# EAGLE board snowflake-hw-v1.0.1 R5 (EAGLE 9.6.2), part 1 of 2
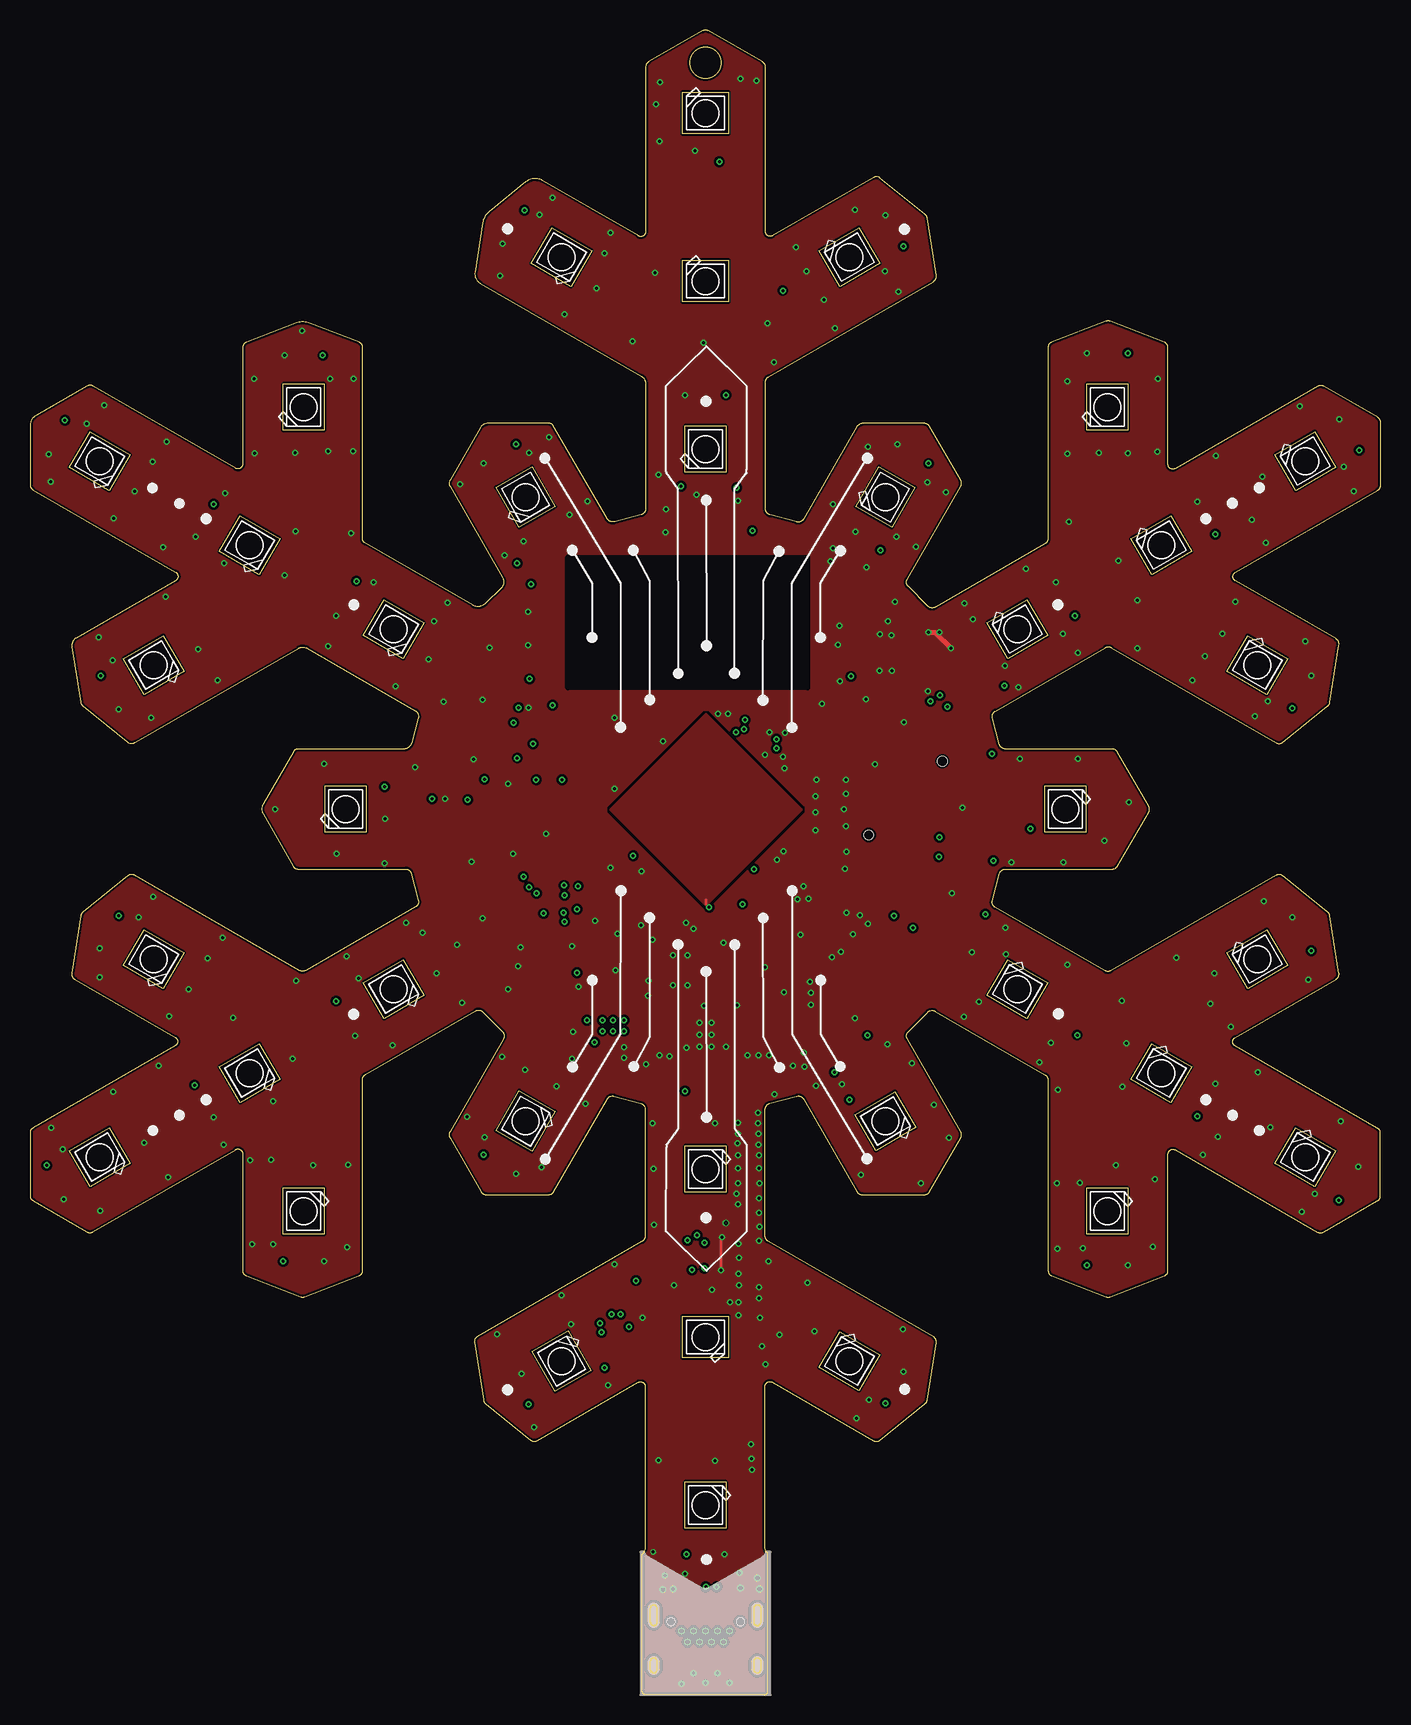
[diagram p2: board, top side]
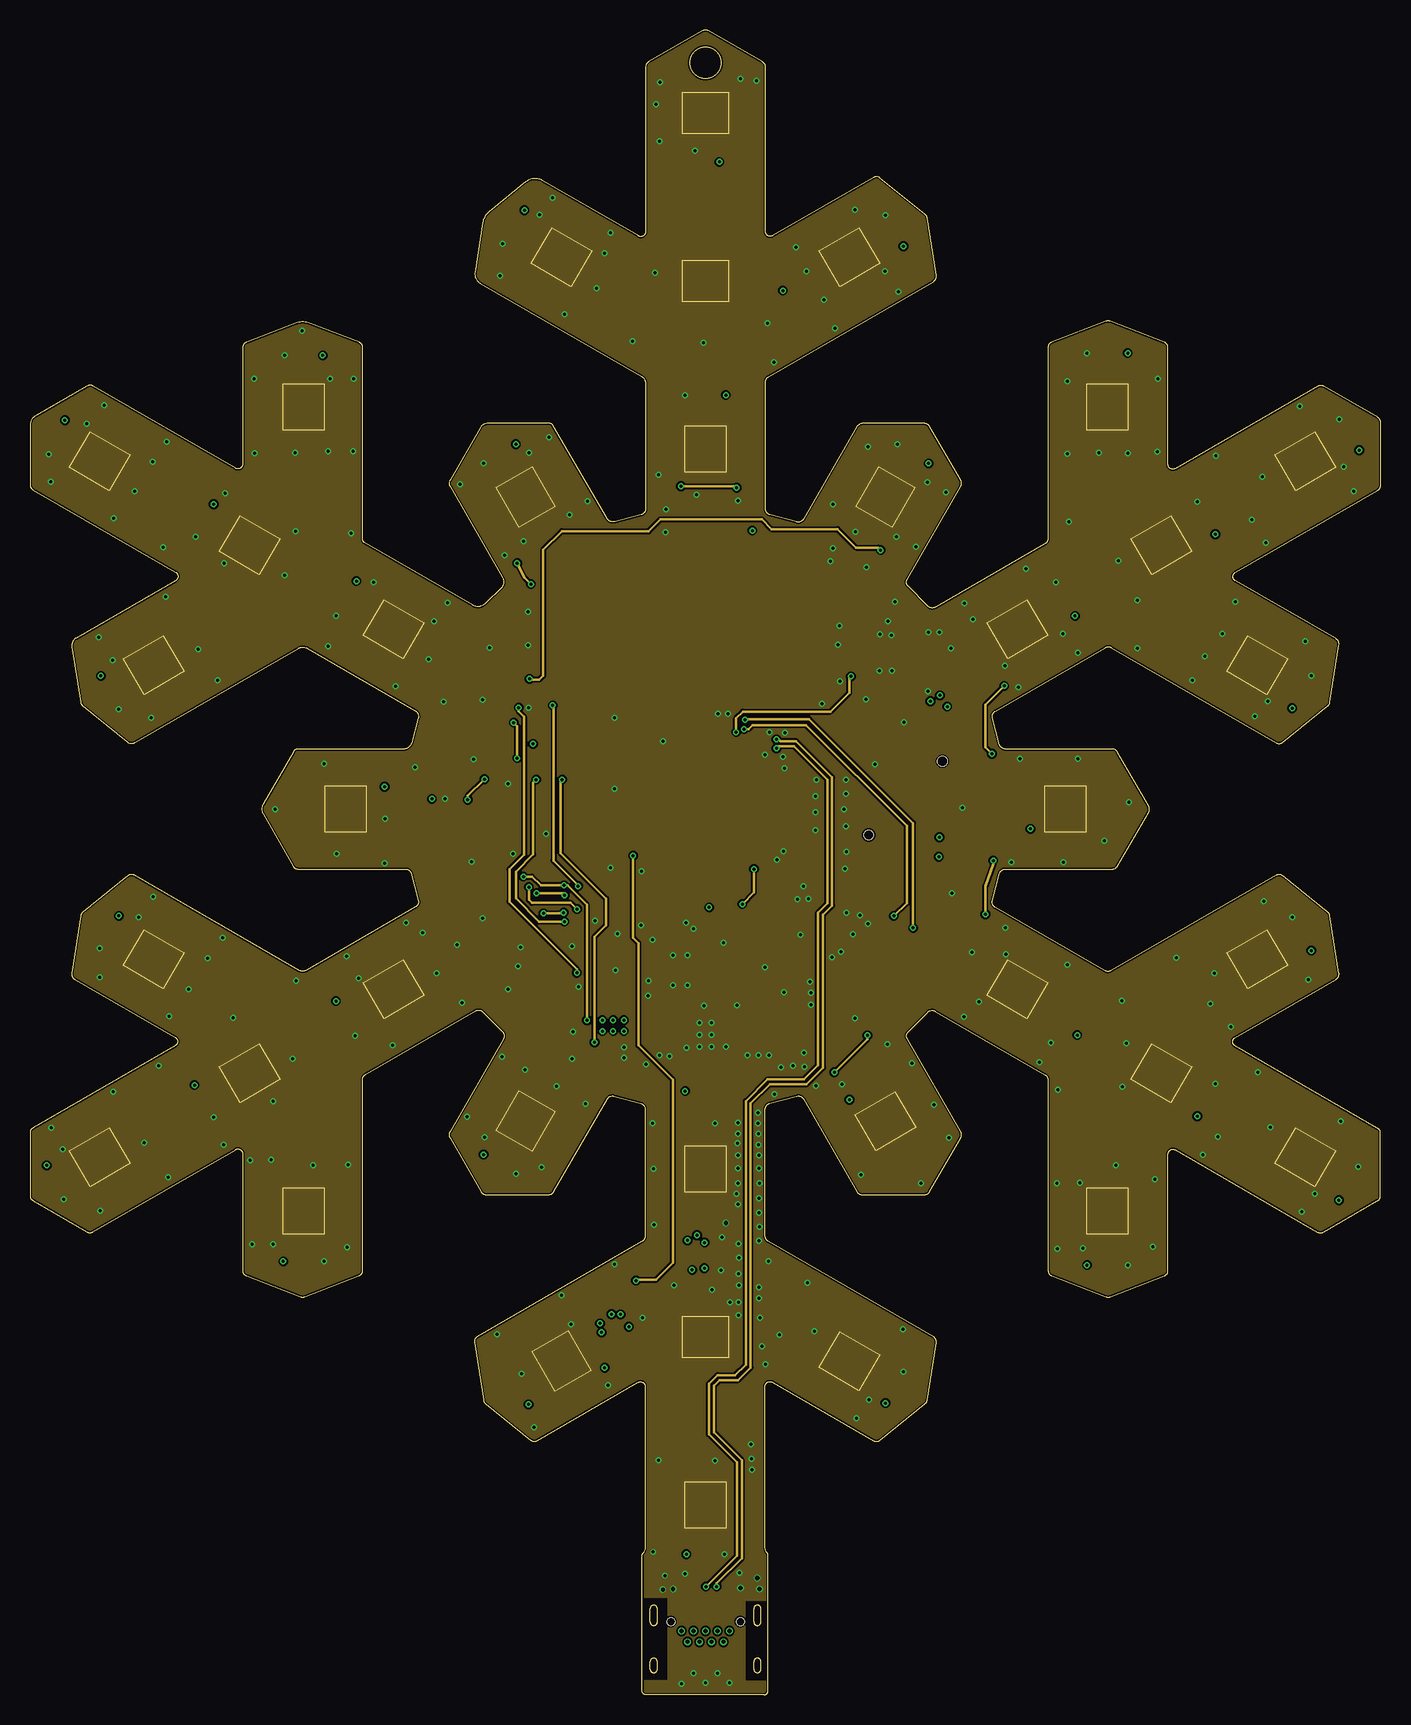
[diagram p3: board, inner layer Route2]
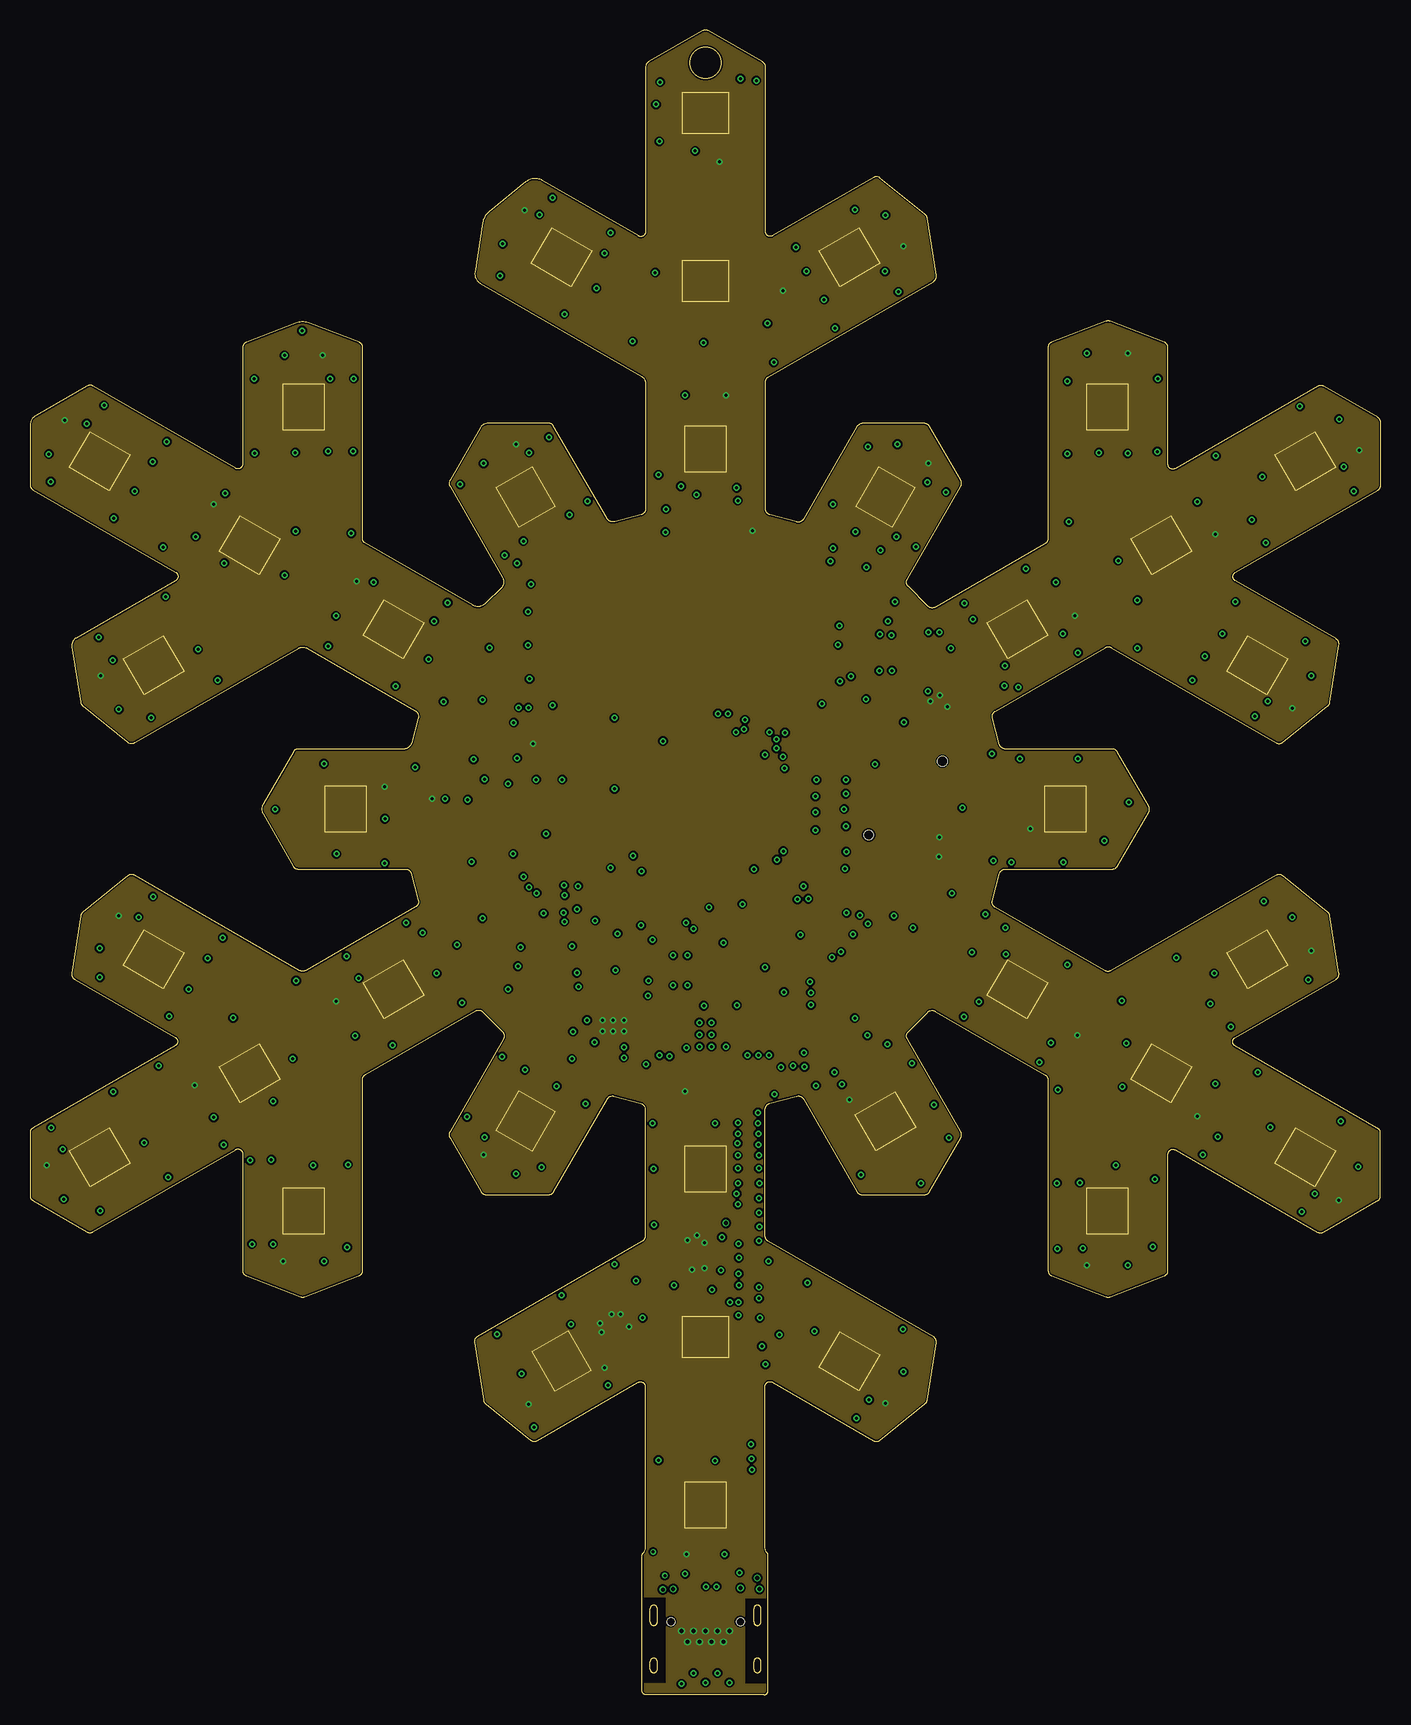
[diagram p4: board, inner layer Route15]
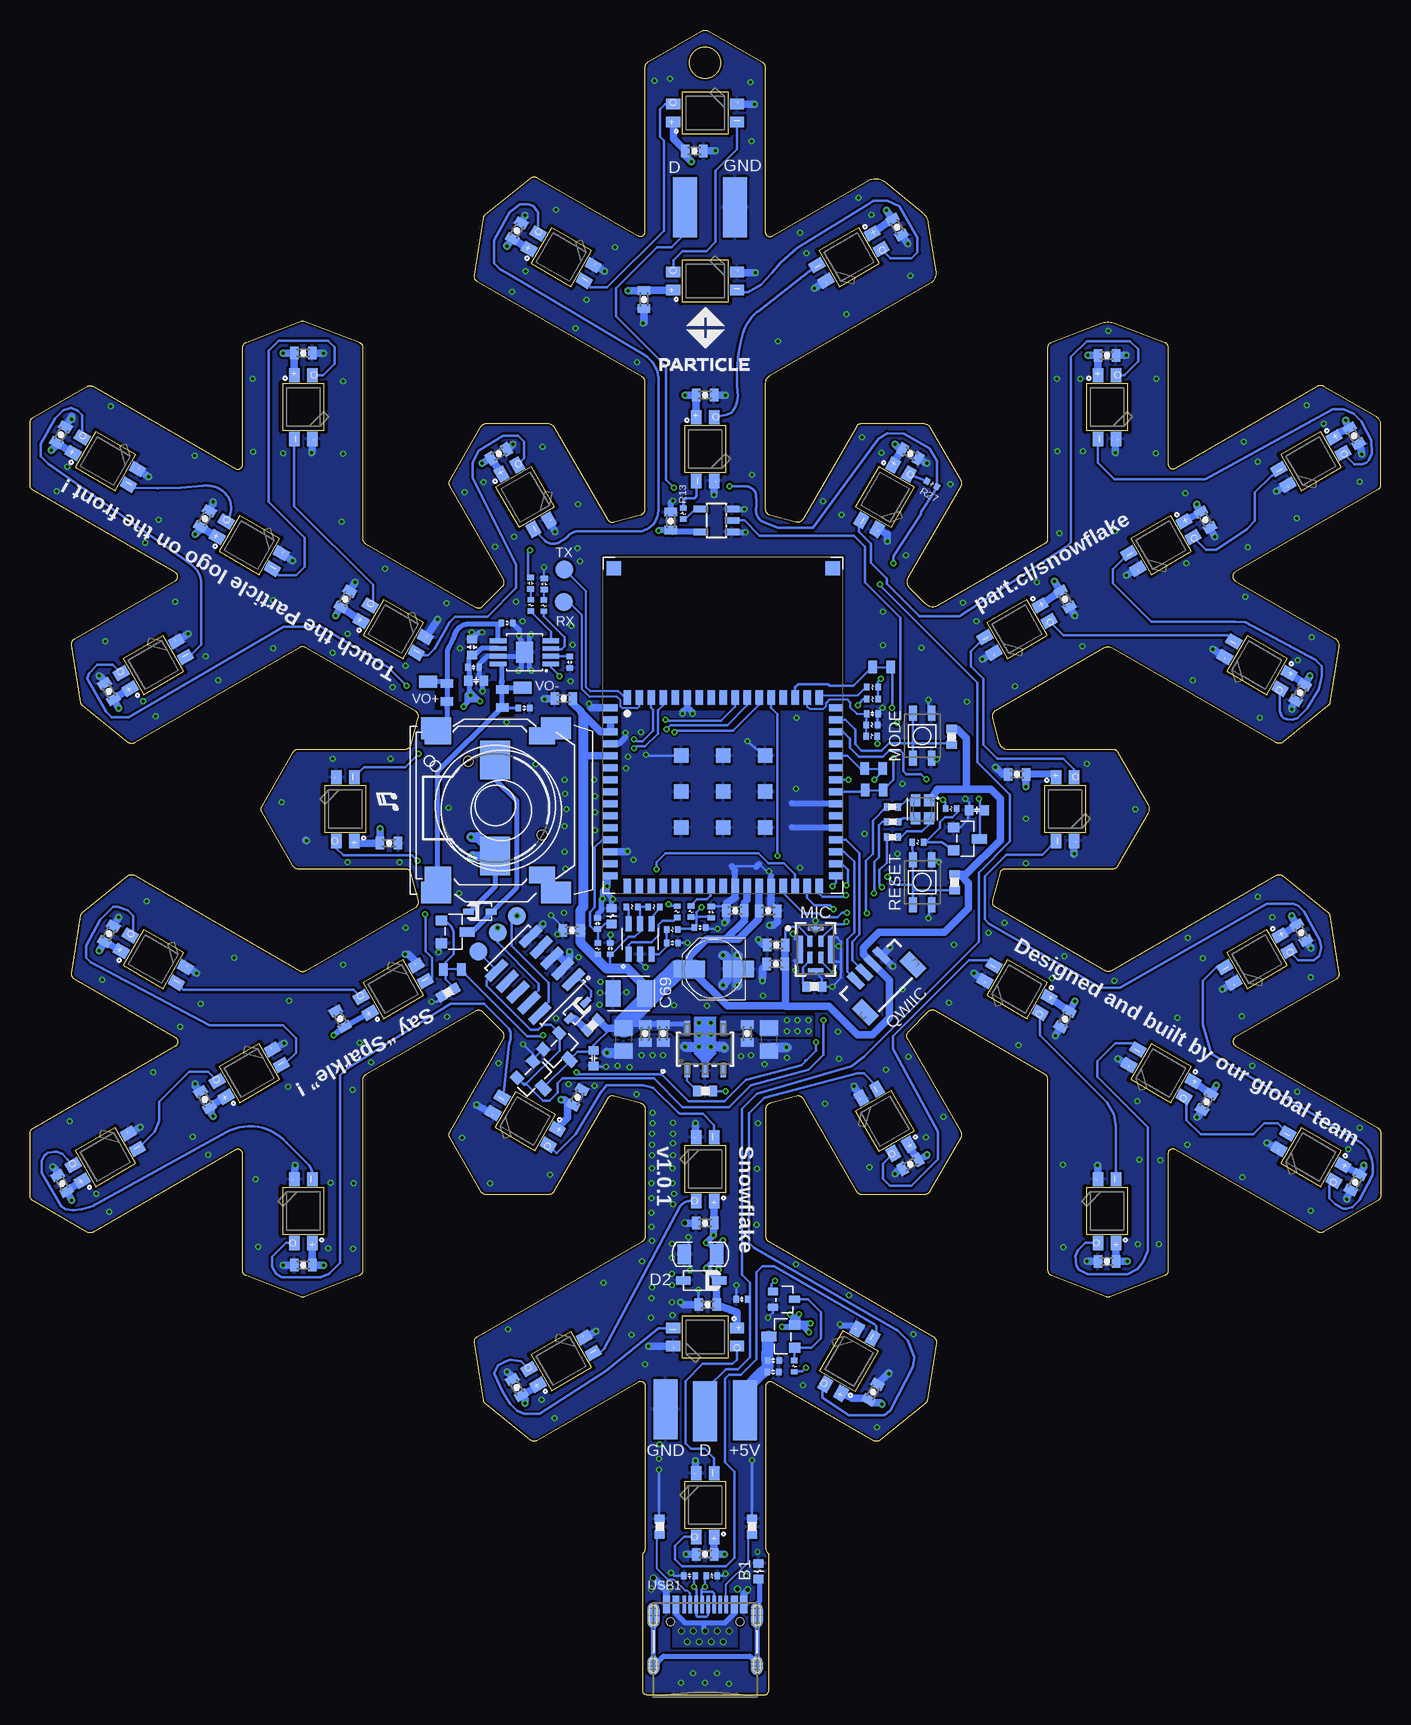
[diagram p5: board, bottom side, seen from below]

Size 112.6 x 138.75 mm. Coordinates in mm from the lower left corner, seen from the top.
Outline: 39.3,92.29 37.95,90.93 arc-75 36.93,90.8 27.92,96 arc-60 27.73,96.33 27.73,112.33 arc69 27.46,112.72 23.31,114.32 arc42 22.15,114.32 18.04,112.73 arc69 17.73,112.28 17.73,102.58 arc-120 17.13,102.23 5.28,109.07 arc60 4.75,109.07 0.46,106.6 arc60 0.01,105.83 0.01,100.83 arc60 0.24,100.44 12.14,93.56 arc-120 12.14,92.87 3.84,88.08 arc69 3.5,87.36 4.23,82.72 arc42 4.39,82.43 8.1,79.44 arc69 8.78,79.38 22.38,87.23 arc-60 23.11,87.23 32.1,82.04 arc-75 32.37,81.41 31.81,79.33 arc-75 31.15,78.83 22.31,78.83 arc60 21.96,78.62 19.42,74.22 arc60 19.42,73.44 21.95,69.05 arc60 22.33,68.83 31.31,68.83 arc-75 31.76,68.48 32.37,66.23 arc-75 32.14,65.67 22.96,60.37 arc-60 22.46,60.37 8.72,68.31 arc69 8.16,68.26 4.4,65.23 arc42 4.22,64.92 3.48,60.16 arc69 3.72,59.65 12.11,54.8 arc-120 12.11,54.11 0.25,47.26 arc60 0,46.82 0,41.63 arc60 0.25,41.2 4.75,38.6 arc60 5.25,38.6 17.13,45.46 arc-120 17.73,45.11 17.73,35.38 arc69 18.05,34.92 22.55,33.18 arc42 22.91,33.18 27.41,34.92 arc69 27.73,35.38 27.73,51.29 arc-60 27.98,51.72 37.14,57.01 arc-75 37.74,56.93 39.39,55.28 arc-75 39.47,54.67 35,46.94 arc60 35,46.44 37.6,41.94 arc60 38.03,41.69 43.23,41.69 arc60 43.66,41.94 48.12,49.67 arc-75 48.69,49.9 50.91,49.3 arc-75 51.28,48.82 51.28,38.23 arc-60 51.03,37.8 37.29,29.86 arc69 37.05,29.35 37.79,24.59 arc42 37.97,24.28 41.73,21.25 arc69 42.29,21.2 50.68,26.05 arc-120 51.28,25.7 51.28,12.34 arc-45 51.05,11.77 arc45 51.01,11.67 51.01,0.4 arc90 51.41,0 61.18,0 arc90 61.51,0.33 61.51,11.73 arc45 61.48,11.8 arc-45 61.28,12.28 61.28,25.72 arc-120 61.88,26.07 70.31,21.2 arc69 70.87,21.25 74.62,24.28 arc42 74.8,24.59 75.55,29.35 arc69 75.31,29.86 61.53,37.82 arc-60 61.28,38.25 61.28,48.81 arc-75 61.65,49.3 63.91,49.9 arc-75 64.47,49.67 68.93,41.94 arc60 69.37,41.69 74.56,41.69 arc60 75,41.94 77.59,46.44 arc60 77.59,46.94 73.13,54.67 arc-75 73.21,55.28 74.84,56.9 arc-75 75.44,56.98 84.62,51.69 arc-60 84.87,51.25 84.87,35.38 arc69 85.19,34.92 89.69,33.18 arc42 90.05,33.18 94.55,34.92 arc69 94.87,35.38 94.87,45.08 arc-120 95.47,45.42 107.33,38.57 arc60 107.83,38.57 112.33,41.17 arc50 112.58,41.51 112.58,46.89 arc54 112.33,47.23 100.45,54.09 arc-120 100.45,54.78 108.88,59.65 arc69 109.12,60.16 108.37,64.92 arc42 108.19,65.23 104.44,68.26 arc69 103.88,68.31 90.1,60.35 arc-60 89.6,60.35 80.45,65.64 arc-75 80.22,66.2 80.83,68.46 arc-75 81.31,68.83 90.23,68.83 arc60 90.66,69.08 93.26,73.58 arc60 93.26,74.08 90.66,78.58 arc60 90.23,78.83 81.31,78.83 arc-75 80.83,79.2 80.23,81.42 arc-75 80.46,81.99 89.63,87.28 arc-60 90.13,87.28 103.88,79.35 arc69 104.44,79.39 108.19,82.42 arc42 108.37,82.73 109.12,87.5 arc69 108.88,88.01 100.48,92.85 arc-120 100.48,93.55 112.35,100.4 arc53 112.6,100.77 112.6,106.08 arc56 112.35,106.46 107.85,109.06 arc60 107.35,109.06 95.47,102.2 arc-120 94.87,102.54 94.87,112.27 arc69 94.55,112.74 90.05,114.47 arc42 89.69,114.47 85.14,112.72 arc69 84.87,112.33 84.87,96.37 arc-60 84.62,95.93 75.46,90.65 arc-75 74.86,90.73 73.21,92.38 arc-75 73.13,92.98 77.59,100.71 arc60 77.59,101.21 75,105.71 arc60 74.56,105.96 69.37,105.96 arc33 68.93,105.71 64.47,97.98 arc-75 63.91,97.75 61.68,98.35 arc-75 61.31,98.84 61.31,109.42 arc-60 61.56,109.86 75.31,117.79 arc69 75.55,118.3 74.8,123.07 arc42 74.62,123.38 70.87,126.41 arc69 70.31,126.45 61.91,121.61 arc-120 61.31,121.95 61.31,135.65 arc60 61.06,136.08 56.56,138.68 arc60 56.06,138.68 51.56,136.08 arc60 51.31,135.65 51.31,121.93 arc-120 50.71,121.59 42.73,126.2 arc69 41.33,126.09 38.27,123.62 arc42 37.73,122.68 37.09,118.58 arc69 37.53,117.65 50.98,109.89 arc-60 51.31,109.31 51.31,98.84 arc-75 50.94,98.36 48.76,97.77 arc-75 48.09,98.05 43.62,105.78 arc60 43.31,105.96 38.1,105.96 arc47 37.57,105.66 35.01,101.22 arc60 35.01,100.71 39.4,93.09 arc-75 39.3,92.29
Outline: circle at 56.31,136.03 radius 1.3
Copper layers (1+2*15+16): Top 0.018mm / dielectric 0.195mm / Route2 0.035mm / dielectric 1.1mm / Route15 0.035mm / dielectric 0.195mm / Bottom 0.018mm
Design rules "particle-4layer *": minimum track width 6mil, minimum drill 0.25mm, track to track 6mil, track to pad 6mil, pad to pad 6mil, via to via 6mil, smd to smd 0mil, copper to edge 6mil, drill to drill 6mil, minimum pad ring 12mil, minimum via ring 4mil, stop-mask expansion 0.01mm, vias tented up to drill 20mil, thermal gap 8mil
Net classes: 0 default: width 0.152 mm, clearance 0.152 mm; 1 usb: width 0.2 mm, clearance 0.2 mm to class 0, clearance 0.2 mm

## Footprints (pad centres in the part's own frame; a part is rotated, then mirrored left to right if it is on the bottom)
TP_2X5MM = smd 2 x 5: P$1 0,0
R-0603A = smd 0.7 x 0.85: 1 -0.65,0; 2 0.65,0
C0603_P = smd 0.711 x 1.041: 1 -0.749,0; 2 0.749,0
C0805 = smd 1.3 x 1.5: 1 -0.95,0; 2 0.95,0
PANASONIC_C = smd 2.6 x 1.4: + 2.05,0; - -2.05,0
C0603 = smd 0.7 x 0.85: 1 -0.65,0; 2 0.65,0
C-0603A = smd 0.7 x 0.85: 1 -0.65,0; 2 0.65,0
C0402 = smd 0.45 x 0.6: 1 -0.47,0; 2 0.47,0
C-0402 = smd 0.45 x 0.55: 1 -0.47,0; 2 0.47,0
C1206 = smd 1.1 x 1.65: 1 -1.35,0; 2 1.35,0
CASE-B = smd 2.2 x 1.25: P$1 0,-1.32; P$2 0,1.32
CONN5X2_1.27 = smd 0.7 x 2.1: 1 -2.54,-2; 2 -2.54,2; 3 -1.27,-2; 4 -1.27,2; 5 0,-2; 6 0,2; 7 1.27,-2; 8 1.27,2; 9 2.54,-2; 10 2.54,2
SOD-323 = smd 0.9 x 0.5: 1 -0.95,0; 2 0.95,0
SOD-123 = smd 1.2 x 0.7: 1 -1.5,0; 2 1.5,0
SOT23-5L = smd 0.55 x 1.2: 1 -0.95,-1.3; 2 0,-1.3; 3 0.95,-1.3; 4 0.95,1.3; 5 -0.95,1.3
JST04_1MM_VERT = smd 0.6 x 1.55: 1 -1.5,0.775; 2 -0.5,0.775; 3 0.5,0.775; 4 1.5,0.775 | smd 1.2 x 2: NC1 -2.8,3.2; NC2 2.8,3.2
PLCC4-2MM-RGB = smd 1 x 0.8: BLUE -0.75,-0.55; CA 0.75,-0.55; GREEN -0.75,0.55; RED 0.75,0.55
NEO3535_REVERSE = smd 1.2 x 0.9 bottom: 1-VDD 2.65,-0.75; 2-DOUT 2.65,0.75; 3-GND -2.65,0.75; 4-DIN -2.65,-0.75
BUZZER-CCV = smd 3.2 x 2.5: + 4,0; - -4,0 | hole 0.8: -3.9,-2.25; 2.25,3.9
SOT323 = smd 0.6 x 0.8: 1 -0.65,-0.95; 2 0.65,-0.95 | smd 0.6 x 0.9: 3 0,0.85
SOT-23 = smd 0.8 x 0.95: 1 -0.95,-1; 2 0.95,-1 | smd 0.8 x 1.25: 3 0,1.15
R0402_P = smd 0.457 x 0.61: 1 -0.483,0; 2 0.483,0
R0603_P = smd 0.7 x 0.85: 1 -0.65,0; 2 0.65,0
R-0402S = smd 0.45 x 0.55: 1 -0.47,0; 2 0.47,0
TACTILE_SWITCH_SMD = smd 1.25 x 0.65: 1 -1.875,0.775; 2 1.875,0.775; 3 -1.875,-0.775; 4 1.875,-0.775
TP = smd 1.5 x 1.5: TP 0,0
P2 = smd 1.2 x 0.6: 1 -9.4,2.45; 2 -9.4,1.45; 3 -9.4,0.45; 4 -9.4,-0.55; 5 -9.4,-1.55; 6 -9.4,-2.55; 7 -9.4,-3.55; 8 -9.4,-4.55; 9 -9.4,-5.55; 10 -9.4,-6.55; 11 -9.4,-7.55; 12 -9.4,-8.55; 13 -9.4,-9.55; 14 -9.4,-10.55; 15 -9.4,-11.55; 33 9.4,-11.55; 34 9.4,-10.55; 35 9.4,-9.55; 36 9.4,-8.55; 37 9.4,-7.55; 38 9.4,-6.55; 39 9.4,-5.55; 40 9.4,-4.55; 41 9.4,-3.55; 42 9.4,-2.55; 43 9.4,-1.55; 44 9.4,-0.55; 45 9.4,0.45; 46 9.4,1.45; 47 9.4,2.45 | smd 0.6 x 1.2: 16 -8,-12.4; 17 -7,-12.4; 18 -6,-12.4; 19 -5,-12.4; 20 -4,-12.4; 21 -3,-12.4; 22 -2,-12.4; 23 -1,-12.4; 24 0,-12.4; 25 1,-12.4; 26 2,-12.4; 27 3,-12.4; 28 4,-12.4; 29 5,-12.4; 30 6,-12.4; 31 7,-12.4; 32 8,-12.4; 48 8,3.3; 49 7,3.3; 50 6,3.3; 51 5,3.3; 52 4,3.3; 53 3,3.3; 54 2,3.3; 55 1,3.3; 56 0,3.3; 57 -1,3.3; 58 -2,3.3; 59 -3,3.3; 60 -4,3.3; 61 -5,3.3; 62 -6,3.3; 63 -7,3.3; 64 -8,3.3 | smd 1.2 x 1.2: 65 -3.5,-1.55; 66 -3.5,-4.55; 67 -3.5,-7.55; 68 0,-1.55; 69 0,-4.55; 70 0,-7.55; 71 3.5,-1.55; 72 3.5,-4.55; 73 3.5,-7.55; 74 9.12,14.07; 75 -9.12,14.07
MP34DT05TR-A_STM = smd 0.406 x 0.94: 1 -0.45,0.675; 2 -0.45,-0.675; 3 0.45,-0.675; 4 0.45,0.675 | smd 1.295 x 0.356: 5 0,1.725; 6 0,-1.725 | smd 0.356 x 2.311: 7 -1.225,0; 8 1.225,0
SOT-89-5_TOR-M = smd 0.483 x 1.118: 1 -1.5,-1.803; 3 1.5,-1.803; 4 1.5,1.803; 5 -1.5,1.803 | smd 0.533 x 1.118: 2 0,-1.803
MSOP-8 = smd 1.4 x 0.4: 1 -2.2,0.975; 2 -2.2,0.325; 3 -2.2,-0.325; 4 -2.2,-0.975; 5 2.2,-0.975; 6 2.2,-0.325; 7 2.2,0.325; 8 2.2,0.975 | smd 1.425 x 1.76: 9 0,0
SOT-23-6 = smd 1.27 x 0.508: 1 -1.27,0.953; 2 -1.27,0; 3 -1.27,-0.953; 4 1.27,-0.953; 5 1.27,0; 6 1.27,0.953
KJL-01304T(13X13MM) = smd 1.4 x 2.2: LEAD+ -5.8,-4.8; LEAD- 5.8,-4.8; P$1 -5.8,3.9; P$2 5.8,3.9
JMP_0603_NC = smd 0.711 x 1.041: 1 -0.749,0; 2 0.749,0
KLJ-01504T = smd 1.8 x 2.5: LEAD+ -6.85,-5.45; LEAD- 6.85,-5.45; P$1 -6.85,4.55; P$2 6.85,4.55
USB-C-16P = smd 0.3 x 1.45: A5 -1.25,0; A6 -0.25,0; A7 0.25,0; A8 1.25,0; B5 1.75,0; B6 0.75,0; B7 -0.75,0; B8 -1.75,0 | smd 0.6 x 1.45: GND -3.225,0; GND2 3.225,0 | smd 1 x 2.1: SHLD1 -4.32,-0.915; SHLD2 4.32,-0.915 | smd 1 x 2.1 bottom: SHLD3 -4.32,-0.915; SHLD4 4.32,-0.915 | smd 1 x 1.6: SHLD5 -4.32,-5.095; SHLD8 4.32,-5.095 | smd 1 x 1.6 bottom: SHLD6 -4.32,-5.095; SHLD7 4.32,-5.095 | smd 0.55 x 1.45: VBUS1 -2.45,0; VBUS2 2.45,0 | hole 0.65: -2.89,-1.445; 2.89,-1.445
TP-1.0X1.5 = smd 1.5 x 1: P$1 0,0

## Placement (x,y rotation side)
+5V_EX  TP2X5MM  [TP_2X5MM]  53.01,23.73 0 bottom
B1  220R  [R-0603A]  51.86,10.31 90 bottom
C1  0.1uF, 16V  [C0603_P]  68.1,83.05 180 bottom
C2  0.1uF, 16V  [C0603_P]  67.41,63.72 180 bottom
C3  0.1uF, 16V  [C0603_P]  53.8,65.37 180 bottom
C4  0.1uF, 16V  [C0603_P]  51.05,65.34 0 bottom
C5  0.1uF, 16V  [C0603_P]  56.31,108.33 180 bottom
C6  0.1uF, 16V  [C0603_P]  59.19,97.82 270 bottom
C7  0.1uF, 16V  [C0603_P]  50.41,60.93 180 bottom
C8  10uF, 16V  [C0603_P]  50.38,62.5 180 bottom
C9  0.1uF, 16V  [C0603_P]  40.31,122.33 120 bottom
C10  0.1uF, 16V  [C0603_P]  61.41,116.29 90 bottom
C11  0.1uF, 16V  [C0603_P]  57.21,128.67 180 bottom
C12  0.1uF, 16V  [C0603_P]  72.01,122.03 240 bottom
C13  0.1uF, 16V  [C0603_P]  73.51,103.43 210 bottom
C14  0.1uF, 16V  [C0603_P]  86.31,91.33 240 bottom
C15  0.1uF, 16V  [C0603_P]  89.81,111.83 180 bottom
C16  0.1uF, 16V  [C0603_P]  52.81,55.13 90 bottom
C17  0.1uF, 16V  [C0603_P]  59.81,55.13 90 bottom
C18  0.01uF, 16V  [C0603_P]  61.31,55.13 270 bottom
C19  22uF, 10V  [C0805]  51.01,54.63 270 bottom
C20  22uF, 10V  [C0805]  63.11,54.63 270 bottom
C21  100uF, 6.3V  [PANASONIC_C]  55.6,60.5 180 bottom
C22  0.1uF, 16V  [C0603_P]  98.01,98.03 240 bottom
C23  0.1uF, 16V  [C0603_P]  110.01,105.03 240 bottom
C24  0.1uF, 16V  [C0603_P]  106.01,83.63 300 bottom
C25  0.1uF, 16V  [C0603_P]  82.66,70.99 180 bottom
C26  0.1uF, 16V  [C0603_P]  86.73,56.35 300 bottom
C27  0.1uF, 16V  [C0603_P]  106.01,63.43 240 bottom
C28  0.1uF, 16V  [C0603_P]  98.01,49.63 300 bottom
C29  0.1uF, 16V  [C0603_P]  109.91,42.63 300 bottom
C30  0.1uF, 16V  [C0603_P]  89.81,35.83 0 bottom
C31  0.1uF, 16V  [C0603_P]  66.95,49.82 240 bottom
C32  0.1uF, 16V  [C0603_P]  56.31,39.33 0 bottom
C33  0.1uF, 16V  [C0603_P]  72.01,25.63 300 bottom
C34  0.1uF, 16V  [C0603_P]  56.1,32.53 0 bottom
C35  0.1uF, 16V  [C0603_P]  56.31,11.73 0 bottom
C36  0.1uF, 16V  [C0603_P]  42.32,25.25 240 bottom
C37  0.1uF, 16V  [C0603_P]  39.21,44.23 30 bottom
C38  0.1uF, 16V  [C0603_P]  26.31,56.33 60 bottom
C39  0.1uF, 16V  [C0603_P]  22.81,36.13 0 bottom
C40  0.1uF, 16V  [C0603_P]  14.51,49.43 60 bottom
C41  0.1uF, 16V  [C0603_P]  2.12,42.73 60 bottom
C42  0.1uF, 16V  [C0603_P]  6.61,63.53 120 bottom
C43  0.1uF, 16V  [C0603_P]  30.31,76.73 0 bottom
C44  0.1uF, 16V  [C0603_P]  26.31,91.33 120 bottom
C45  0.1uF, 16V  [C0603_P]  6.71,83.53 60 bottom
C46  0.1uF, 16V  [C0603_P]  14.61,97.93 120 bottom
C47  0.1uF, 16V  [C0603_P]  2.21,104.93 120 bottom
C48  0.1uF, 16V  [C0603_P]  22.81,111.63 180 bottom
C49  0.1uF, 16V  [C0603_P]  39.21,103.43 150 bottom
C50  0.1uF  [C0603]  75.73,87.33 90 bottom
C51  10uF  [C-0603A]  75.4,84.52 0 bottom
C52  2.2uF  [C0402]  70.86,92.65 90 bottom
C53  nc  [C-0402]  72.82,89.33 180 bottom
C54  nc  [C-0402]  71.4,82.24 0 bottom
C55  0.1uF  [C-0603A]  65.62,53.07 90 bottom
C56  10pF  [C-0402]  53.25,32.98 0 bottom
C57  1000pF  [C-0402]  42.37,81.77 180 bottom
C58  2.2uF  [C0402]  69.72,92.58 90 bottom
C59  0.22uF  [C-0402]  67.59,86.06 270 bottom
C60  0.1uF  [C-0402]  50.65,26.92 180 bottom
C61  1000F  [C-0402]  50.62,27.87 180 bottom
C62  0.1uF  [C-0603A]  33.65,73.73 0 bottom
C63  1000pF  [C-0402]  75.63,85.65 0 bottom
C64  2.2uF  [C-0402]  65.28,64.29 270 bottom
C65  NC  [C-0402]  56.74,63.96 0 bottom
C66  33P  [C-0402]  59.04,62.67 180 bottom
C67  0.1uF  [C-0402]  64.22,62.2 270 bottom
C68  100uF  [C1206]  56.7,36.74 180 bottom
C69  100uF nc  [CASE-B]  62.68,58.46 90 bottom
CONN1  CONN5X2  [CONN5X2_1.27]  70.49,60 135 bottom
D1  nc  [SOD-323]  75.11,65.27 180 bottom
D2  NC  [SOD-123]  56.62,34.55 0 bottom
D3  LXES15AAA1-133  [C0402]  55.81,65.24 90 bottom
D4  nc  [C0402]  57.62,9.94 180 bottom
D5  nc  [C0402]  55.76,9.94 0 bottom
D6  LRB551V-30 nc  [SOD-323]  66.94,57.07 45 bottom
DATA  TP2X5MM  [TP_2X5MM]  56.31,23.65 0 bottom
DATA1  TP2X5MM  [TP_2X5MM]  58.01,123.96 0 bottom
GND  TP2X5MM  [TP_2X5MM]  59.61,23.81 0 bottom
GND115  TP2X5MM  [TP_2X5MM]  53.81,123.96 0 bottom
IC1  74AHC1G125  [SOT23-5L]  55.37,97.88 90 bottom
J1  [JST04_1MM_VERT]  43.24,61.14 225 bottom
LED1  RGB-LED-CLMVB-FKARGB  [PLCC4-2MM-RGB]  38.21,73.83 90 bottom
LED2  WS2812B_SK6812E  [NEO3535_REVERSE]  56.31,103.83 90 top
LED3  WS2812B_SK6812E  [NEO3535_REVERSE]  44.31,119.83 150 top
LED4  WS2812B_SK6812E  [NEO3535_REVERSE]  56.31,117.83 0 top
LED5  WS2812B_SK6812E  [NEO3535_REVERSE]  56.31,131.83 0 top
LED6  WS2812B_SK6812E  [NEO3535_REVERSE]  68.31,119.83 30 top
LED7  WS2812B_SK6812E  [NEO3535_REVERSE]  71.31,99.83 60 top
LED8  WS2812B_SK6812E  [NEO3535_REVERSE]  82.31,88.83 30 top
LED9  WS2812B_SK6812E  [NEO3535_REVERSE]  89.81,107.33 90 top
LED10  WS2812B_SK6812E  [NEO3535_REVERSE]  94.31,95.83 30 top
LED11  WS2812B_SK6812E  [NEO3535_REVERSE]  106.31,102.83 30 top
LED12  WS2812B_SK6812E  [NEO3535_REVERSE]  102.31,85.83 330 top
LED13  WS2812B_SK6812E  [NEO3535_REVERSE]  86.31,73.83 270 top
LED14  WS2812B_SK6812E  [NEO3535_REVERSE]  82.31,58.83 330 top
LED15  WS2812B_SK6812E  [NEO3535_REVERSE]  102.31,61.33 30 top
LED16  WS2812B_SK6812E  [NEO3535_REVERSE]  94.31,51.83 330 top
LED17  WS2812B_SK6812E  [NEO3535_REVERSE]  106.31,44.83 330 top
LED18  WS2812B_SK6812E  [NEO3535_REVERSE]  89.81,40.33 270 top
LED19  WS2812B_SK6812E  [NEO3535_REVERSE]  71.31,47.83 210 top
LED20  WS2812B_SK6812E  [NEO3535_REVERSE]  56.31,43.83 270 top
LED21  WS2812B_SK6812E  [NEO3535_REVERSE]  68.31,27.83 330 top
LED22  WS2812B_SK6812E  [NEO3535_REVERSE]  56.31,29.83 180 top
LED23  WS2812B_SK6812E  [NEO3535_REVERSE]  56.31,15.83 270 top
LED24  WS2812B_SK6812E  [NEO3535_REVERSE]  44.31,27.83 300 top
LED25  WS2812B_SK6812E  [NEO3535_REVERSE]  41.31,47.83 240 top
LED26  WS2812B_SK6812E  [NEO3535_REVERSE]  30.31,58.83 210 top
LED27  WS2812B_SK6812E  [NEO3535_REVERSE]  22.81,40.33 270 top
LED28  WS2812B_SK6812E  [NEO3535_REVERSE]  18.31,51.83 210 top
LED29  WS2812B_SK6812E  [NEO3535_REVERSE]  5.81,44.83 210 top
LED30  WS2812B_SK6812E  [NEO3535_REVERSE]  10.31,61.33 150 top
LED31  WS2812B_SK6812E  [NEO3535_REVERSE]  26.31,73.83 90 top
LED32  WS2812B_SK6812E  [NEO3535_REVERSE]  30.31,88.83 150 top
LED33  WS2812B_SK6812E  [NEO3535_REVERSE]  10.31,85.83 210 top
LED34  WS2812B_SK6812E  [NEO3535_REVERSE]  18.31,95.83 150 top
LED35  WS2812B_SK6812E  [NEO3535_REVERSE]  5.81,102.83 150 top
LED36  WS2812B_SK6812E  [NEO3535_REVERSE]  22.81,107.33 90 top
LED37  WS2812B_SK6812E  [NEO3535_REVERSE]  41.31,99.83 120 top
LS1  nc  [BUZZER-CCV]  73.81,73.91 270 bottom
Q2  2N7002  [SOT323]  49.71,32.97 270 bottom
Q3  IRLML6401  [SOT-23]  49.85,29.89 90 bottom
Q4  nc  [SOT-23]  77.29,63.6 270 bottom
R1  1K  [R0402_P]  40.71,74.01 180 bottom
R2  1K  [R0402_P]  40.68,72.78 180 bottom
R3  1K  [R0402_P]  40.7,71.49 180 bottom
R4  10K  [R0603_P]  35.76,79.84 90 bottom
R5  nc  [R0603_P]  35.51,67.73 90 bottom
R6  10K  [R0603_P]  47.21,59.03 180 bottom
R7  nc  [R0603_P]  65.71,55.83 45 bottom
R8  nc  [R0603_P]  77.74,58.54 30 bottom
R9  5K1  [R0603_P]  52.41,14.03 270 bottom
R10  5K1  [R0603_P]  60.11,14.03 270 bottom
R11  100K  [R0603_P]  56.31,50.33 0 bottom
R12  NC  [R-0402S]  57.49,65.29 270 bottom
R13  200R  [R-0402S]  58.14,98.46 270 bottom
R14  1K  [R-0402S]  42.36,84 0 bottom
R15  20k  [R-0402S]  69.77,90.78 270 bottom
R16  NC  [R-0402S]  35.8,73.86 180 bottom
R17  20k  [R-0402S]  70.84,90.8 270 bottom
R18  0R  [R-0402S]  38.57,71.06 180 bottom
R19  10K  [R-0402S]  42.4,80.83 180 bottom
R20  10K  [R-0402S]  42.43,79.9 0 bottom
R21  10K  [R-0402S]  48.87,27.41 270 bottom
R22  100K  [R-0402S]  65.26,62.2 90 bottom
R23  2K  [R-0402S]  59.05,63.8 180 bottom
R24  0R  [R-0402S]  58.65,65.26 270 bottom
R25  10k  [R-0402S]  60.57,65.68 180 bottom
R26  NC  [R-0402S]  62.41,65.68 0 bottom
R27  200R  [R-0402S]  37.41,100.92 150 bottom
R41  NCP18WF104F12RB  [R-0603A]  64.11,64.91 90 bottom
R66  1K  [R-0402S]  42.37,83 0 bottom
S1  [TACTILE_SWITCH_SMD]  38.21,79.93 90 bottom
S2  [TACTILE_SWITCH_SMD]  38.21,67.73 90 bottom
TP1  TP-1.5MM  [TP]  75.23,61.98 90 bottom
TP5  TP-1.5MM  [TP]  68.04,93.79 0 bottom
TP6  TP-1.5MM  [TP]  68.1,91.06 0 bottom
TP7  TP-1.5MM  [TP]  73.61,63.53 90 bottom
TP8  TP-1.5MM  [TP]  72.01,64.93 90 bottom
U1  P2  [P2]  54.81,79.83 0 bottom
U2  MP34DT05TR-A  [MP34DT05TR-A_STM]  47.11,62.13 0 bottom
U3  XC6220B331PR-G  [SOT-89-5_TOR-M]  56.31,53.83 0 bottom
U4  APX803L20-41SA  [SOT-23]  34.61,71.35 270 bottom
U5  RT9818C-30GV  [SOT-23]  68.43,53.78 225 bottom
U6  TPA6211A1  [MSOP-8]  71.37,86.89 180 bottom
U7  PT2041A  [SOT-23-6]  61.75,63.01 90 bottom
U8  NC  [SOT-23]  70.62,51.41 225 bottom
U$1  SEPAKER  [KJL-01304T(13X13MM)]  73.81,74.13 270 bottom
U$2  JMP_0603_NC  [JMP_0603_NC]  77.4,60.48 180 bottom
U$3  JMP_0603_NC  [JMP_0603_NC]  42.25,77.2 0 bottom
U$4  JMP_0603_NC  [JMP_0603_NC]  41.58,85.65 0 bottom
U$5  SEPAKER15X15MM  [KLJ-01504T]  73.31,73.71 270 bottom
U$6  JMP_0603_NC  [JMP_0603_NC]  73.24,83.06 270 bottom
U$7  JMP_0603_NC  [JMP_0603_NC]  77.86,83.53 270 bottom
U$15  JMP_0603_NC  [JMP_0603_NC]  42.22,75.41 0 bottom
USB1  [USB-C-16P]  56.32,7.55 0 bottom
VO+  TP1.0X1.5  [TP-1.0X1.5]  79.41,84.45 180 bottom
VO-  TP1.0X1.5  [TP-1.0X1.5]  71.55,83.93 0 bottom